# EAGLE design main (EAGLE 7.2.0)
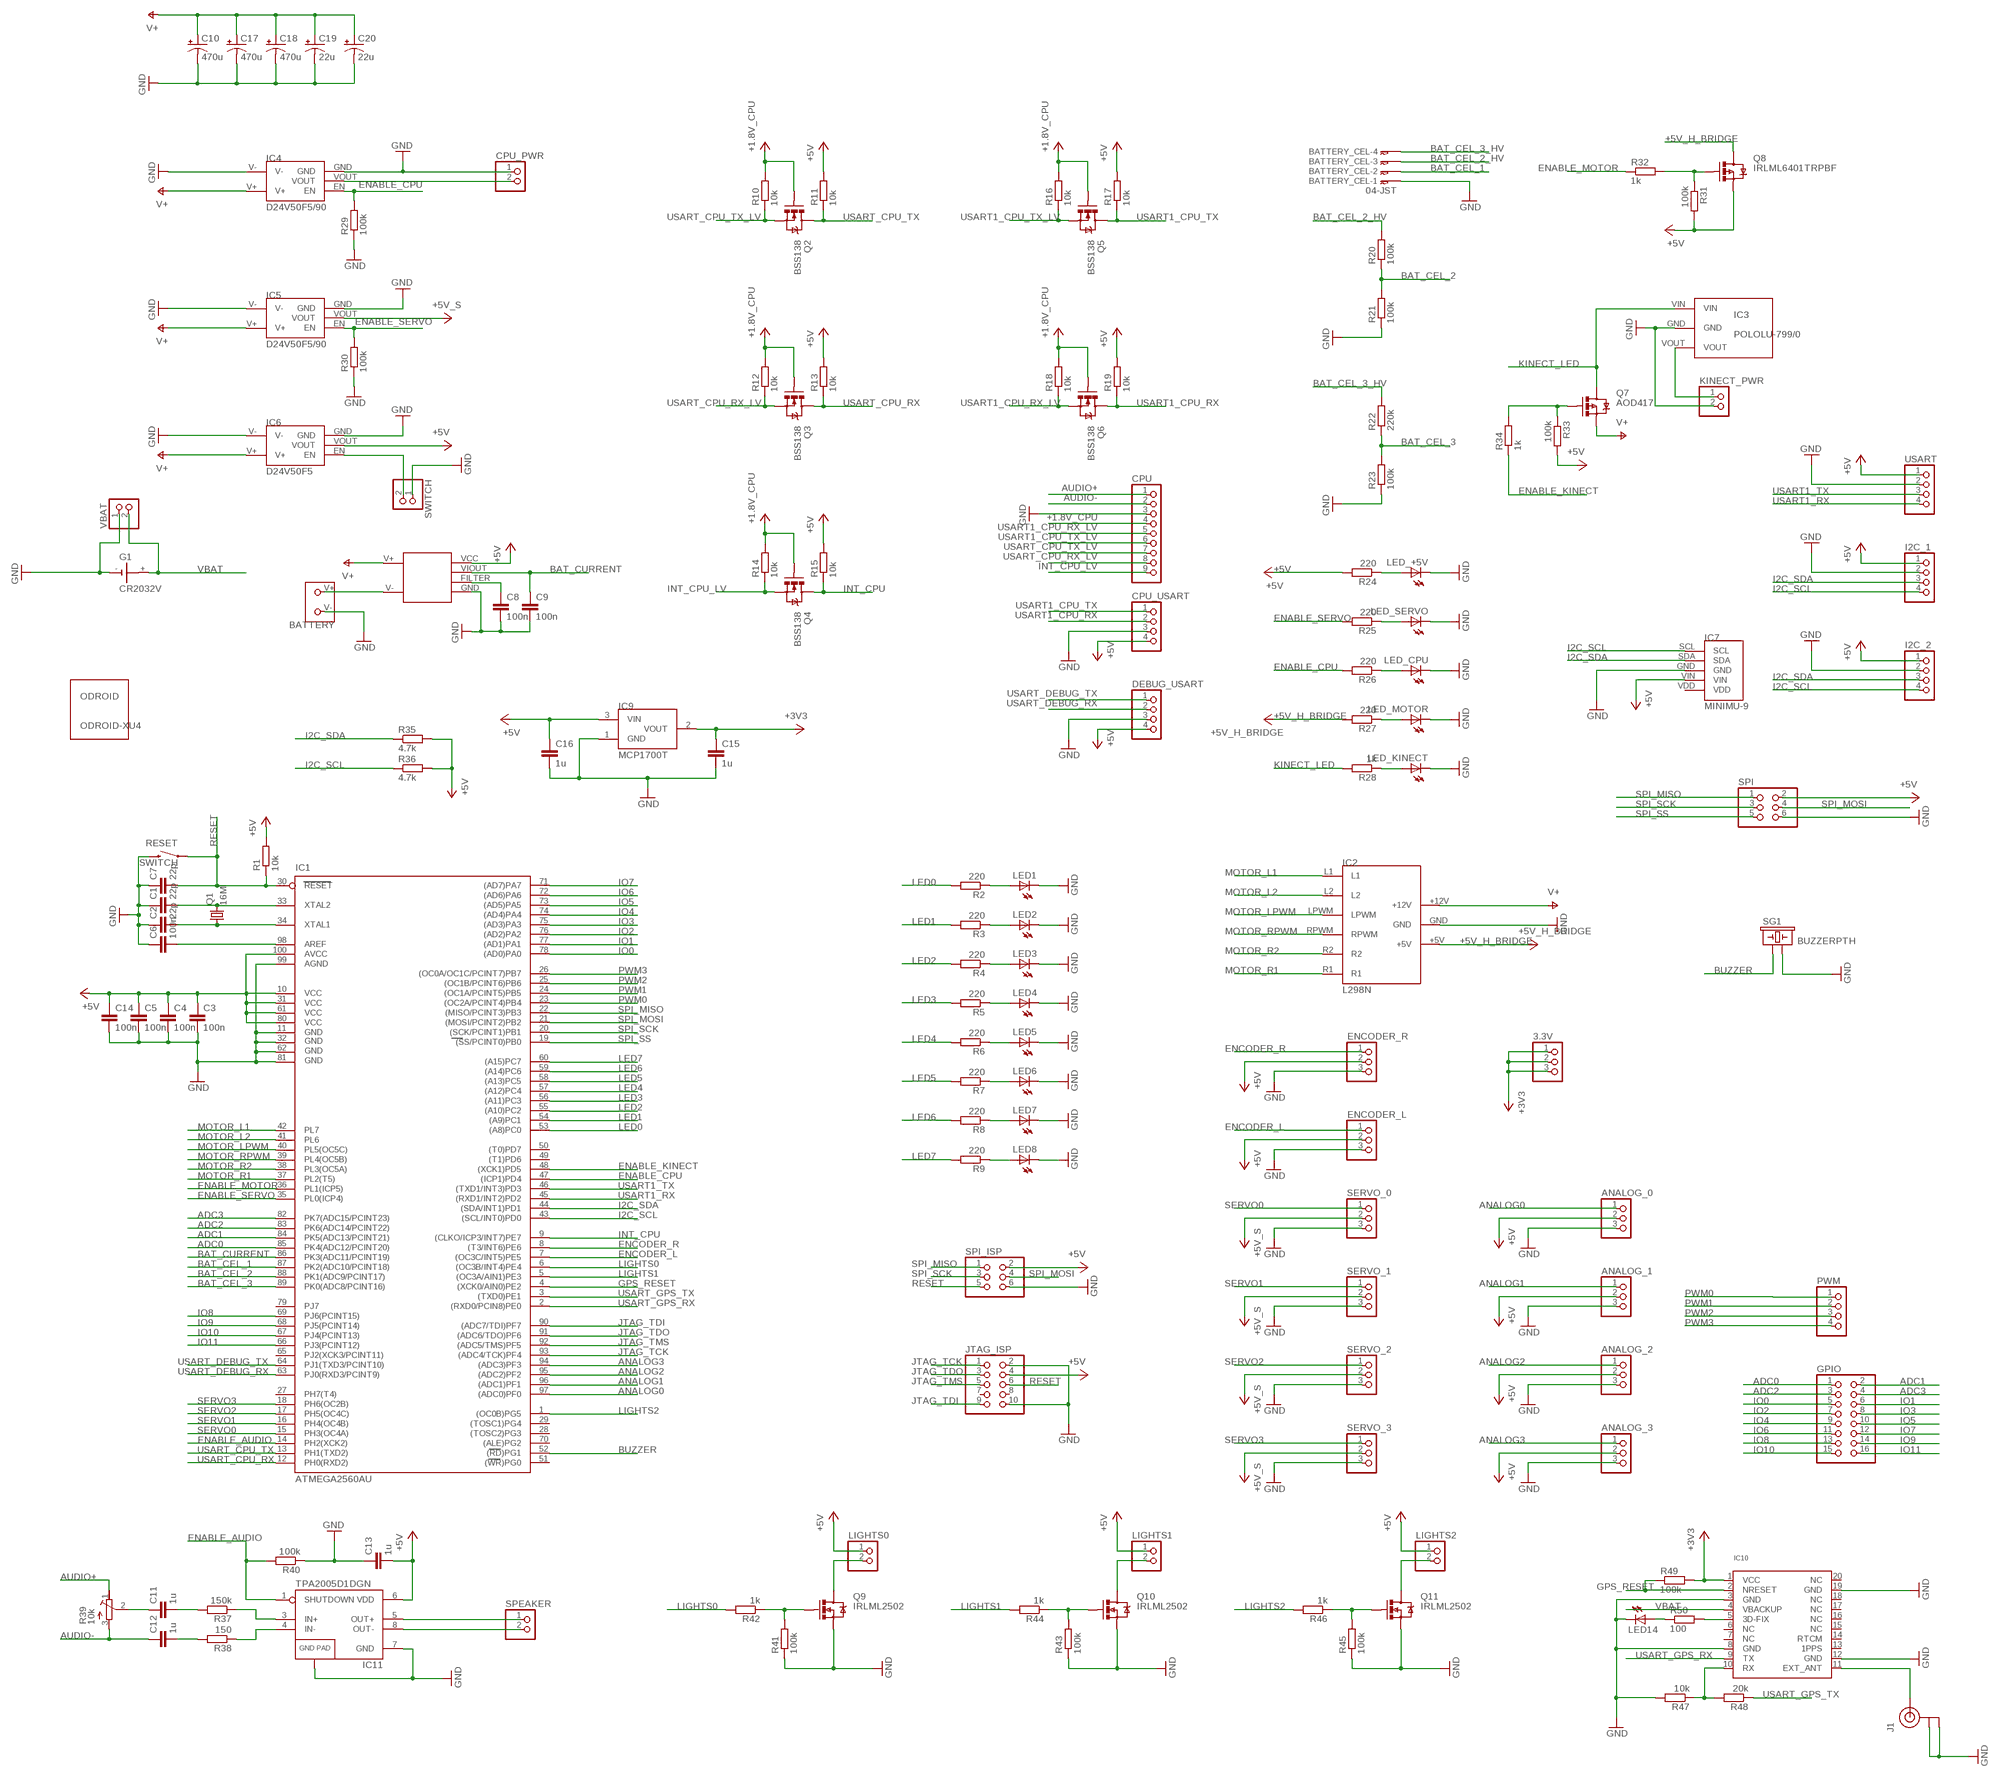
[diagram p0: schematic, sheet 1]

## Parts
3.3V  PINHD-1X3  [1X03]
ANALOG_0  PINHD-1X3  [1X03]
ANALOG_1  PINHD-1X3  [1X03]
ANALOG_2  PINHD-1X3  [1X03]
ANALOG_3  PINHD-1X3  [1X03]
BATTERY  XT60  [XT60]
BATTERY_CEL  04-JST  04-JST-B4B-XH-A  [B4B-XH]
C1  22p  C-EUC0805  [C0805]
C2  22p  C-EUC0805  [C0805]
C3  100n  C-EUC0805  [C0805]
C4  100n  C-EUC0805  [C0805]
C5  100n  C-EUC0805  [C0805]
C6  100n  C-EUC0805  [C0805]
C7  22p  C-EUC0805  [C0805]
C8  100n  C-EUC0805  [C0805]
C9  100n  C-EUC0805  [C0805]
C10  470u  CAP_POLG  [PANASONIC_G]
C11  1u  C-EUC0805  [C0805]
C12  1u  C-EUC0805  [C0805]
C13  1u  C-EUC0805  [C0805]
C14  100n  C-EUC0805  [C0805]
C15  1u  C-EUC0805  [C0805]
C16  1u  C-EUC0805  [C0805]
C17  470u  CAP_POLG  [PANASONIC_G]
C18  470u  CAP_POLG  [PANASONIC_G]
C19  22u  CAP_POL6032  [EIA6032]
C20  22u  CAP_POL6032  [EIA6032]
CPU  PINHD-1X9  [1X09]
CPU_PWR  PINHD-1X2  [1X02]
CPU_USART  PINHD-1X4/90  [1X04/90]
DEBUG_USART  PINHD-1X4/90  [1X04/90]
ENCODER_L  PINHD-1X3  [1X03]
ENCODER_R  PINHD-1X3  [1X03]
G1  CR2032V  [CR2032V]
GPIO  PINHD-2X8  [2X08]
I2C_1  PINHD-1X4  [1X04]
I2C_2  PINHD-1X4  [1X04]
IC1  ATMEGA2560AU  [TQFP100]
IC2  L298N  [L298N-MOD]
IC3  POLOLU-799/0  [POLOLU799/0]
IC4  D24V50F5/90  [D24V50/90]
IC5  D24V50F5/90  [D24V50/90]
IC6  D24V50F5  [D24V50]
IC7  MINIMU-9  [MINIMU-9_V3]
IC8  ACS715  [ACS71X]
IC9  MCP1700T  [SOT23]
IC10  GPS_FGPMMOPA6H  [FGPMMOPA6H]
IC11  TPA2005D1DGN  [POWER-SOP8]
J1  U.FL  [U.FL]
JTAG_ISP  PINHD-2X5/90  [2X05/90]
KINECT_PWR  PINHD-1X2  [1X02]
LED1  LEDCHIPLED_0805  [CHIPLED_0805]
LED2  LEDCHIPLED_0805  [CHIPLED_0805]
LED3  LEDCHIPLED_0805  [CHIPLED_0805]
LED4  LEDCHIPLED_0805  [CHIPLED_0805]
LED5  LEDCHIPLED_0805  [CHIPLED_0805]
LED6  LEDCHIPLED_0805  [CHIPLED_0805]
LED7  LEDCHIPLED_0805  [CHIPLED_0805]
LED8  LEDCHIPLED_0805  [CHIPLED_0805]
LED14  LEDCHIPLED_0805  [CHIPLED_0805]
LED_+5V  LEDCHIPLED_0805  [CHIPLED_0805]
LED_CPU  LEDCHIPLED_0805  [CHIPLED_0805]
LED_KINECT  LEDCHIPLED_0805  [CHIPLED_0805]
LED_MOTOR  LEDCHIPLED_0805  [CHIPLED_0805]
LED_SERVO  LEDCHIPLED_0805  [CHIPLED_0805]
LIGHTS0  PINHD-1X2  [1X02]
LIGHTS1  PINHD-1X2  [1X02]
LIGHTS2  PINHD-1X2  [1X02]
ODROID  ODROID-XU4  [ODROID-XU4]
PWM  PINHD-1X4  [1X04]
Q1  16M  CRYSTALTXC-7A  [CRYSTAL-TXC-7A]
Q2  BSS138  MOSFET-NCHANNELBSS138  [SOT23-3]
Q3  BSS138  MOSFET-NCHANNELBSS138  [SOT23-3]
Q4  BSS138  MOSFET-NCHANNELBSS138  [SOT23-3]
Q5  BSS138  MOSFET-NCHANNELBSS138  [SOT23-3]
Q6  BSS138  MOSFET-NCHANNELBSS138  [SOT23-3]
Q7  AOD417  [TO252]
Q8  IRLML6401TRPBF  [SOT23]
Q9  IRLML2502  [SOT23]
Q10  IRLML2502  [SOT23]
Q11  IRLML2502  [SOT23]
R1  10k  R-EU_R0805  [R0805]
R2  220  R-EU_R0805  [R0805]
R3  220  R-EU_R0805  [R0805]
R4  220  R-EU_R0805  [R0805]
R5  220  R-EU_R0805  [R0805]
R6  220  R-EU_R0805  [R0805]
R7  220  R-EU_R0805  [R0805]
R8  220  R-EU_R0805  [R0805]
R9  220  R-EU_R0805  [R0805]
R10  10k  R-EU_R0805  [R0805]
R11  10k  R-EU_R0805  [R0805]
R12  10k  R-EU_R0805  [R0805]
R13  10k  R-EU_R0805  [R0805]
R14  10k  R-EU_R0805  [R0805]
R15  10k  R-EU_R0805  [R0805]
R16  10k  R-EU_R0805  [R0805]
R17  10k  R-EU_R0805  [R0805]
R18  10k  R-EU_R0805  [R0805]
R19  10k  R-EU_R0805  [R0805]
R20  100k  R-EU_R0805  [R0805]
R21  100k  R-EU_R0805  [R0805]
R22  220k  R-EU_R0805  [R0805]
R23  100k  R-EU_R0805  [R0805]
R24  220  R-EU_R0805  [R0805]
R25  220  R-EU_R0805  [R0805]
R26  220  R-EU_R0805  [R0805]
R27  220  R-EU_R0805  [R0805]
R28  1k  R-EU_R0805  [R0805]
R29  100k  R-EU_R0805  [R0805]
R30  100k  R-EU_R0805  [R0805]
R31  100k  R-EU_R0805  [R0805]
R32  1k  R-EU_R0805  [R0805]
R33  100k  R-EU_R0805  [R0805]
R34  1k  R-EU_R0805  [R0805]
R35  4.7k  R-EU_R0805  [R0805]
R36  4.7k  R-EU_R0805  [R0805]
R37  150k  R-EU_R0805  [R0805]
R38  150  R-EU_R0805  [R0805]
R39  10k  R-TRIMM3314G  [RTRIM3314G]
R40  100k  R-EU_R0805  [R0805]
R41  100k  R-EU_R0805  [R0805]
R42  1k  R-EU_R0805  [R0805]
R43  100k  R-EU_R0805  [R0805]
R44  1k  R-EU_R0805  [R0805]
R45  100k  R-EU_R0805  [R0805]
R46  1k  R-EU_R0805  [R0805]
R47  10k  R-EU_R0805  [R0805]
R48  20k  R-EU_R0805  [R0805]
R49  100k  R-EU_R0805  [R0805]
R50  100  R-EU_R0805  [R0805]
RESET  SWITCH  SWITCH-MOMENTARY-2SMD-4  [TACTILE_SWITCH_TALL]
SERVO_0  PINHD-1X3  [1X03]
SERVO_1  PINHD-1X3  [1X03]
SERVO_2  PINHD-1X3  [1X03]
SERVO_3  PINHD-1X3  [1X03]
SG1  BUZZERPTH  [BUZZER-12MM]
SPEAKER  PINHD-1X2  [1X02]
SPI  PINHD-2X3  [2X03]
SPI_ISP  PINHD-2X3  [2X03]
SWITCH  PINHD-1X2/90  [1X02/90]
USART  PINHD-1X4  [1X04]
VBAT  PINHD-1X2  [1X02]

## Nets
+1.8V_CPU: CPU.4 Q2.1(G) Q3.1(G) Q4.1(G) Q5.1(G) Q6.1(G) R10.2 R12.2 R14.2 R16.2 R18.2
+3V3: 3.3V.1 3.3V.2 3.3V.3 C15.1 IC9.2(VOUT) IC10.1(VCC) R49.2
+5V: ANALOG_0.2 ANALOG_1.2 ANALOG_2.2 ANALOG_3.2 C3.1 C4.1 C5.1 C13.2 C14.1 C16.1 CPU_USART.4 DEBUG_USART.4 ENCODER_L.2 ENCODER_R.2 I2C_1.1 I2C_2.1 IC1.10(VCC) IC1.31(VCC1) IC1.61(VCC2) IC1.80(VCC3) IC1.100(AVCC) IC6.VOUT IC7.VIN IC8.VCC IC9.3(VIN) IC11.6(VDD) JTAG_ISP.4 LIGHTS0.1 LIGHTS1.1 LIGHTS2.1 Q8.2(S) R1.2 R11.2 R13.2 R15.2 R17.2 R19.2 R24.2 R31.2 R33.2 R35.2 R36.2 SPI.2 SPI_ISP.2 USART.1
+5V_CPU: CPU_PWR.2 IC4.VOUT
+5V_H_BRIDGE: IC2.+5V Q8.3(D) R27.2
+5V_S: IC5.VOUT SERVO_0.2 SERVO_1.2 SERVO_2.2 SERVO_3.2
ADC0: GPIO.1 IC1.85(PK4(ADC12/PCINT20))
ADC1: GPIO.2 IC1.84(PK5(ADC13/PCINT21))
ADC2: GPIO.3 IC1.83(PK6(ADC14/PCINT22))
ADC3: GPIO.4 IC1.82(PK7(ADC15/PCINT23))
ANALOG0: ANALOG_0.1 IC1.97((ADC0)PF0)
ANALOG1: ANALOG_1.1 IC1.96((ADC1)PF1)
ANALOG2: ANALOG_2.1 IC1.95((ADC2)PF2)
ANALOG3: ANALOG_3.1 IC1.94((ADC3)PF3)
AUDIO+: CPU.1 R39.1(E)
AUDIO-: C12.1 CPU.2 R39.3(A)
BAT_CEL_1: BATTERY_CEL.P$2 IC1.87(PK2(ADC10/PCINT18))
BAT_CEL_2: IC1.88(PK1(ADC9/PCINT17)) R20.1 R21.2
BAT_CEL_2_HV: BATTERY_CEL.P$3 R20.2
BAT_CEL_3: IC1.89(PK0(ADC8/PCINT16)) R22.1 R23.2
BAT_CEL_3_HV: BATTERY_CEL.P$4 R22.2
BAT_CURRENT: C9.1 IC1.86(PK3(ADC11/PCINT19)) IC8.VIOUT
BUZZER: IC1.52((RD)PG1) SG1.+
ENABLE: IC6.EN SWITCH.2
ENABLE_AUDIO: IC1.14(PH2(XCK2)) IC11.1(SHUTDOWN) R40.2
ENABLE_CPU: IC1.47((ICP1)PD4) IC4.EN R26.2 R29.2
ENABLE_KINECT: IC1.48((XCK1)PD5) R34.1
ENABLE_MOTOR: IC1.36(PL1(ICP5)) R32.1
ENABLE_SERVO: IC1.35(PL0(ICP4)) IC5.EN R25.2 R30.2
ENCODER_L: ENCODER_L.1 IC1.7((OC3C/INT5)PE5)
ENCODER_R: ENCODER_R.1 IC1.8((T3/INT6)PE6)
GND: ANALOG_0.3 ANALOG_1.3 ANALOG_2.3 ANALOG_3.3 BATTERY.V- BATTERY_CEL.P$1 C1.1 C2.1 C3.2 C4.2 C5.2 C6.1 C7.1 C8.2 C9.2 C10.- C13.1 C14.2 C15.2 C16.2 C17.- C18.- C19.P$2(-) C20.P$2(-) CPU.3 CPU_PWR.1 CPU_USART.3 DEBUG_USART.3 ENCODER_L.3 ENCODER_R.3 G1.- I2C_1.2 I2C_2.2 IC1.11(GND) IC1.32(GND1) IC1.62(GND2) IC1.81(GND3) IC1.99(AGND) IC2.GND IC3.GND IC4.GND IC4.V- IC5.GND IC5.V- IC6.GND IC6.V- IC7.GND IC8.GND IC9.1(GND) IC10.3(GND) IC10.8(GND) IC10.12(GND) IC10.19(GND) IC11.7(GND) IC11.9(GND) J1.P$1(GND) J1.P$2(GND) JTAG_ISP.2 JTAG_ISP.10 KINECT_PWR.2 LED1.C LED2.C LED3.C LED4.C LED5.C LED6.C LED7.C LED8.C LED14.C LED_+5V.C LED_CPU.C LED_KINECT.C LED_MOTOR.C LED_SERVO.C Q9.2(S) Q10.2(S) Q11.2(S) R21.1 R23.1 R29.1 R30.1 R40.1 R41.1 R43.1 R45.1 R47.2 RESET.B2 SERVO_0.3 SERVO_1.3 SERVO_2.3 SERVO_3.3 SG1.- SPI.6 SPI_ISP.6 SWITCH.1 USART.2 VBAT.1
GPS_RESET: IC1.4((XCK0/AIN0)PE2) IC10.2(NRESET) R49.1
I2C_SCL: I2C_1.4 I2C_2.4 IC1.43((SCL/INT0)PD0) IC7.SCL R36.1
I2C_SDA: I2C_1.3 I2C_2.3 IC1.44((SDA/INT1)PD1) IC7.SDA R35.1
INT_CPU: IC1.9((CLKO/ICP3/INT7)PE7) Q4.3(D) R15.1
INT_CPU_LV: CPU.9 Q4.2(S) R14.1
IO0: GPIO.5 IC1.78((AD0)PA0)
IO1: GPIO.6 IC1.77((AD1)PA1)
IO2: GPIO.7 IC1.76((AD2)PA2)
IO3: GPIO.8 IC1.75((AD3)PA3)
IO4: GPIO.9 IC1.74((AD4)PA4)
IO5: GPIO.10 IC1.73((AD5)PA5)
IO6: GPIO.11 IC1.72((AD6)PA6)
IO7: GPIO.12 IC1.71((AD7)PA7)
IO8: GPIO.13 IC1.69(PJ6(PCINT15))
IO9: GPIO.14 IC1.68(PJ5(PCINT14))
IO10: GPIO.15 IC1.67(PJ4(PCINT13))
IO11: GPIO.16 IC1.66(PJ3(PCINT12))
JTAG_TCK: IC1.93((ADC4/TCK)PF4) JTAG_ISP.1
JTAG_TDI: IC1.90((ADC7/TDI)PF7) JTAG_ISP.9
JTAG_TDO: IC1.91((ADC6/TDO)PF6) JTAG_ISP.3
JTAG_TMS: IC1.92((ADC5/TMS)PF5) JTAG_ISP.5
KINECT_LED: IC3.VIN Q7.3(D) R28.2
LED0: IC1.53((A8)PC0) R2.2
LED1: IC1.54((A9)PC1) R3.2
LED2: IC1.55((A10)PC2) R4.2
LED3: IC1.56((A11)PC3) R5.2
LED4: IC1.57((A12)PC4) R6.2
LED5: IC1.58((A13)PC5) R7.2
LED6: IC1.59((A14)PC6) R8.2
LED7: IC1.60((A15)PC7) R9.2
LIGHTS0: IC1.6((OC3B/INT4)PE4) R42.2
LIGHTS1: IC1.5((OC3A/AIN1)PE3) R44.2
LIGHTS2: IC1.1((OC0B)PG5) R46.2
MOTOR_L1: IC1.42(PL7) IC2.L1
MOTOR_L2: IC1.41(PL6) IC2.L2
MOTOR_LPWM: IC1.40(PL5(OC5C)) IC2.LPWM
MOTOR_R1: IC1.37(PL2(T5)) IC2.R1
MOTOR_R2: IC1.38(PL3(OC5A)) IC2.R2
MOTOR_RPWM: IC1.39(PL4(OC5B)) IC2.RPWM
N$1: C1.2 IC1.33(XTAL2) Q1.P$2
N$2: C2.2 IC1.34(XTAL1) Q1.P$1
N$3: C6.2 IC1.98(AREF)
N$4: LED1.A R2.1
N$5: LED2.A R3.1
N$6: LED3.A R4.1
N$7: LED4.A R5.1
N$8: LED5.A R6.1
N$9: LED6.A R7.1
N$10: LED7.A R8.1
N$11: LED8.A R9.1
N$12: LED_+5V.A R24.1
N$13: BATTERY.V+ IC8.V-
N$14: Q8.1(G) R31.1 R32.2
N$15: IC3.VOUT KINECT_PWR.1
N$16: LED_SERVO.A R25.1
N$17: C8.1 IC8.FILTER
N$18: LED_CPU.A R26.1
N$19: LED_MOTOR.A R27.1
N$20: LED_KINECT.A R28.1
N$21: Q7.1(G) R33.1 R34.2
N$22: IC11.3(IN+) R37.1
N$23: IC11.4(IN-) R38.1
N$24: C11.2 R37.2
N$25: C12.2 R38.2
N$26: IC11.5(OUT+) SPEAKER.1
N$27: C11.1 R39.2(S)
N$28: IC11.8(OUT-) SPEAKER.2
N$29: LIGHTS0.2 Q9.3(D)
N$30: Q9.1(G) R41.2 R42.1
N$31: LIGHTS1.2 Q10.3(D)
N$32: Q10.1(G) R43.2 R44.1
N$33: LIGHTS2.2 Q11.3(D)
N$34: Q11.1(G) R45.2 R46.1
N$35: IC10.10(RX) R47.1 R48.2
N$36: IC10.5(3D-FIX) R50.2
N$37: LED14.A R50.1
N$38: IC10.11(EXT_ANT) J1.P$3(SIGNAL)
PWM0: IC1.23((OC2A/PCINT4)PB4) PWM.1
PWM1: IC1.24((OC1A/PCINT5)PB5) PWM.2
PWM2: IC1.25((OC1B/PCINT6)PB6) PWM.3
PWM3: IC1.26((OC0A/OC1C/PCINT7)PB7) PWM.4
RESET: C7.2 IC1.30(RESET) JTAG_ISP.6 R1.1 RESET.A2 SPI_ISP.5
SERVO0: IC1.15(PH3(OC4A)) SERVO_0.1
SERVO1: IC1.16(PH4(OC4B)) SERVO_1.1
SERVO2: IC1.17(PH5(OC4C)) SERVO_2.1
SERVO3: IC1.18(PH6(OC2B)) SERVO_3.1
SPI_MISO: IC1.22((MISO/PCINT3)PB3) SPI.1 SPI_ISP.1
SPI_MOSI: IC1.21((MOSI/PCINT2)PB2) SPI.4 SPI_ISP.4
SPI_SCK: IC1.20((SCK/PCINT1)PB1) SPI.3 SPI_ISP.3
SPI_SS: IC1.19((SS/PCINT0)PB0) SPI.5
USART1_CPU_RX: CPU_USART.2 Q6.3(D) R19.1
USART1_CPU_RX_LV: CPU.5 Q6.2(S) R18.1
USART1_CPU_TX: CPU_USART.1 Q5.3(D) R17.1
USART1_CPU_TX_LV: CPU.6 Q5.2(S) R16.1
USART1_RX: IC1.45((RXD1/INT2)PD2) USART.4
USART1_TX: IC1.46((TXD1/INT3)PD3) USART.3
USART_CPU_RX: IC1.12(PH0(RXD2)) Q3.3(D) R13.1
USART_CPU_RX_LV: CPU.8 Q3.2(S) R12.1
USART_CPU_TX: IC1.13(PH1(TXD2)) Q2.3(D) R11.1
USART_CPU_TX_LV: CPU.7 Q2.2(S) R10.1
USART_DEBUG_RX: DEBUG_USART.2 IC1.63(PJ0(RXD3/PCINT9))
USART_DEBUG_TX: DEBUG_USART.1 IC1.64(PJ1(TXD3/PCINT10))
USART_GPS_RX: IC1.2((RXD0/PCIN8)PE0) IC10.9(TX)
USART_GPS_TX: IC1.3((TXD0)PE1) R48.1
V+: C10.+ C17.+ C18.+ C19.P$1(+) C20.P$1(+) IC2.+12V IC4.V+ IC5.V+ IC6.V+ IC8.V+ Q7.2(S)
VBAT: G1.+ IC10.4(VBACKUP) VBAT.2
Unconnected: G1.+@1(+) IC1.27(PH7(T4)) IC1.28((TOSC2)PG3) IC1.29((TOSC1)PG4) IC1.49((T1)PD6) IC1.50((T0)PD7) IC1.51((WR)PG0) IC1.65(PJ2(XCK3/PCINT11)) IC1.70((ALE)PG2) IC1.79(PJ7) IC7.VDD IC10.6(NC) IC10.7(NC) IC10.13(1PPS) IC10.14(RTCM) IC10.15(NC) IC10.16(NC) IC10.17(NC) IC10.18(NC) IC10.20(NC) JTAG_ISP.7 JTAG_ISP.8

## Library data of the parts
3.3V ANALOG_0 ANALOG_1-ANALOG_3 ENCODER_L ENCODER_R SERVO_0 SERVO_1-SERVO_3 = pinhead:PINHD-1X3: PIN HEADER
BATTERY = parts:XT60
BATTERY_CEL = bt_con-jst-xh:04-JST: JST CONNECTOR
C1-C9 C11-C16 = resistor:C-EU: CAPACITOR, European symbol
C10 C17 C18 = SparkFun-Capacitors:CAP_POL: Capacitor Polarized These are standard SMD and PTH capacitors. Normally 10uF, 47uF, and 100uF in electrolytic and tantalum varieties. Always verify the external diameter of the through hole cap, it varies with capacity, voltage, and manufacturer. The EIA devices should be standard.
C19 C20 = SparkFun-Passives:CAP_POL: Capacitor Polarized These are standard SMD and PTH capacitors. Normally 10uF, 47uF, and 100uF in electrolytic and tantalum varieties. Always verify the external diameter of the through hole cap, it varies with capacity, voltage, and manufacturer. The EIA devices should be standard.
CPU = pinhead:PINHD-1X9: PIN HEADER
CPU_PWR KINECT_PWR LIGHTS0 LIGHTS1 LIGHTS2 SPEAKER SWITCH VBAT = pinhead:PINHD-1X2: PIN HEADER
CPU_USART DEBUG_USART I2C_1 I2C_2 PWM USART = pinhead:PINHD-1X4: PIN HEADER
G1 = battery:CR2032V: LI BATTERY Varta
GPIO = pinhead:PINHD-2X8: PIN HEADER
IC1 = SmartPrj:ATMEGA2560: MICROCONTROLLER 64/128/256 Kbytes FLASH 4 Kbytes EEPROM 8 Kbytes SRAM 86 General Purpose I/O pins 12-channels16-bit PWM 4 x Serial USARTs 16-channels 10-bit A/D
IC2 = parts:L298N
IC3 = parts:POLOLU-799
IC4-IC6 = parts:D24V50F5
IC7 = parts:MINIMU-9
IC8 = parts:ACS715
IC9 = parts:MCP1700T
IC10 = Simplex-ICs:GPS_FGPMMOPA6H: GPS Module - MTK MT3339 Chipset, -165dBm sensitivity, 22 channels, 10Hz, auto-select external antenna options
IC11 = SparkFun-AnalogIC:TPA2005D1: 1.4W MONO CLASS-D AUDIO POWER AMPLIFIER The TPA2005D1 is a 1.4-W high efficiency filter-free class-D audio power amplifier in a BGA, QFN, or MSOP package that requires only three external components. Datasheet: http://focus.ti.com/lit/ds/symlink/tpa2005d1.pdf 1.4 W Into 8 ? From a 5V Supply at THD = 10% (Typ) Maximum Battery Life and Minimum Heat Efficiency With an 8-? Speaker: 84% at 400 mW, 79% at 100 mW 2.8-mA Quiescent Current 0.5-mA Shutdown Current Ideal for Wireless or Cellular Handsets and PDAs Capable of Driving an 8-? Speaker (2.5 V ? VDD ? 5.5 V) and a 4-? Speaker (2.5 V ? VDD ? 4.2 V) Only Three External Components Optimized PWM Output Stage Eliminates LC Output Filter Internally Generated 250-kHz Switching Frequency Eliminates Capacitor and Resistor Improved PSRR (-71 dB at 217 Hz) and Wide Supply Voltage (2.5 V to 5.5 V) Eliminates Need for a Voltage Regulator Fully Differential Design Reduces RF Rectification and Eliminates Bypass Capacitor Improved CMRR Eliminates Two Input Coupling Capacitors
J1 = SparkFun-Connectors:U.FL: SMD antenna connector- WRL-09144; PROD_ID: CONN-09193
JTAG_ISP = pinhead:PINHD-2X5: PIN HEADER
LED1-LED8 LED14 LED_+5V LED_CPU LED_KINECT LED_MOTOR LED_SERVO = led:LED: LED OSRAM: - CHIPLED LG R971, LG N971, LY N971, LG Q971, LY Q971, LO R971, LY R971 LH N974, LH R974 LS Q976, LO Q976, LY Q976 LO Q996 - Hyper CHIPLED LW Q18S LB Q993, LB Q99A, LB R99A - SideLED LS A670, LO A670, LY A670, LG A670, LP A670 LB A673, LV A673, LT A673, LW A673 LH A674 LY A675 LS A676, LA A676, LO A676, LY A676, LW A676 LS A679, LY A679, LG A679 - Hyper Micro SIDELED® LS Y876, LA Y876, LO Y876, LY Y876 LT Y87S - SmartLED LW L88C, LW L88S LB L89C, LB L89S, LG L890 LS L89K, LO L89K, LY L89K LS L896, LA L896, LO L896, LY L896 - TOPLED LS T670, LO T670, LY T670, LG T670, LP T670 LSG T670, LSP T670, LSY T670, LOP T670, LYG T670 LG T671, LOG T671, LSG T671 LB T673, LV T673, LT T673, LW T673 LH T674 LS T676, LA T676, LO T676, LY T676, LB T676, LH T676, LSB T676, LW T676 LB T67C, LV T67C, LT T67C, LS T67K, LO T67K, LY T67K, LW E67C LS E67B, LA E67B, LO E67B, LY E67B, LB E67C, LV E67C, LT E67C LW T67C LS T679, LY T679, LG T679 LS T770, LO T770, LY T770, LG T770, LP T770 LB T773, LV T773, LT T773, LW T773 LH T774 LS E675, LA E675, LY E675, LS T675 LS T776, LA T776, LO T776, LY T776, LB T776 LHGB T686 LT T68C, LB T68C - Hyper Mini TOPLED® LB M676 - Mini TOPLED Santana® LG M470 LS M47K, LO M47K, LY M47K Source: http://www.osram.convergy.de LUXEON: - LUMILED® LXK2-PW12-R00, LXK2-PW12-S00, LXK2-PW14-U00, LXK2-PW14-V00 LXK2-PM12-R00, LXK2-PM12-S00, LXK2-PM14-U00 LXK2-PE12-Q00, LXK2-PE12-R00, LXK2-PE12-S00, LXK2-PE14-T00, LXK2-PE14-U00 LXK2-PB12-K00, LXK2-PB12-L00, LXK2-PB12-M00, LXK2-PB14-N00, LXK2-PB14-P00, LXK2-PB14-Q00 LXK2-PR12-L00, LXK2-PR12-M00, LXK2-PR14-Q00, LXK2-PR14-R00 LXK2-PD12-Q00, LXK2-PD12-R00, LXK2-PD12-S00 LXK2-PH12-R00, LXK2-PH12-S00 LXK2-PL12-P00, LXK2-PL12-Q00, LXK2-PL12-R00 Source: www.luxeon.com KINGBRIGHT: KA-3528ASYC Source: www.kingbright.com
ODROID = parts:ODROID-XU4
Q1 = SparkFun-FreqCtrl:CRYSTAL: Various standard crystals. Proven footprints.
Q2-Q6 = SparkFun-DiscreteSemi:MOSFET-NCHANNEL: Common NMOSFET Parts MFG P/N Store ID Prod ID FDD8780 TRANS-09984 SI7820DN TRANS-11055 FDS6630A IC-08089 2N7002PW TRANS-11151 FQP30N06L COM-10213 TRANS-10060 BSS123LT1G TRANS-08345 BSS138 TRANS-00830 BS170 2N7000; PROD_ID: TRANS-00830; VALUE: 200mA/50V
Q7 = parts:AOD417
Q8 = parts:IRLML6401TRPBF
Q9-Q11 = parts:IRLML2502
R1-R38 R40-R50 = resistor:R-EU_: RESISTOR, European symbol
R39 = resistor:R-TRIMM: Trimm resistor
RESET = SparkFun-Electromechanical:SWITCH-MOMENTARY-2: Various NO switches- pushbuttons, reed, etc; PROD_ID: SWCH-11966
SG1 = SparkFun-Electromechanical:BUZZER: Buzzer 12mm Spark Fun Electronics SKU : Comp-Buzzer
SPI SPI_ISP = pinhead:PINHD-2X3: PIN HEADER

## Board
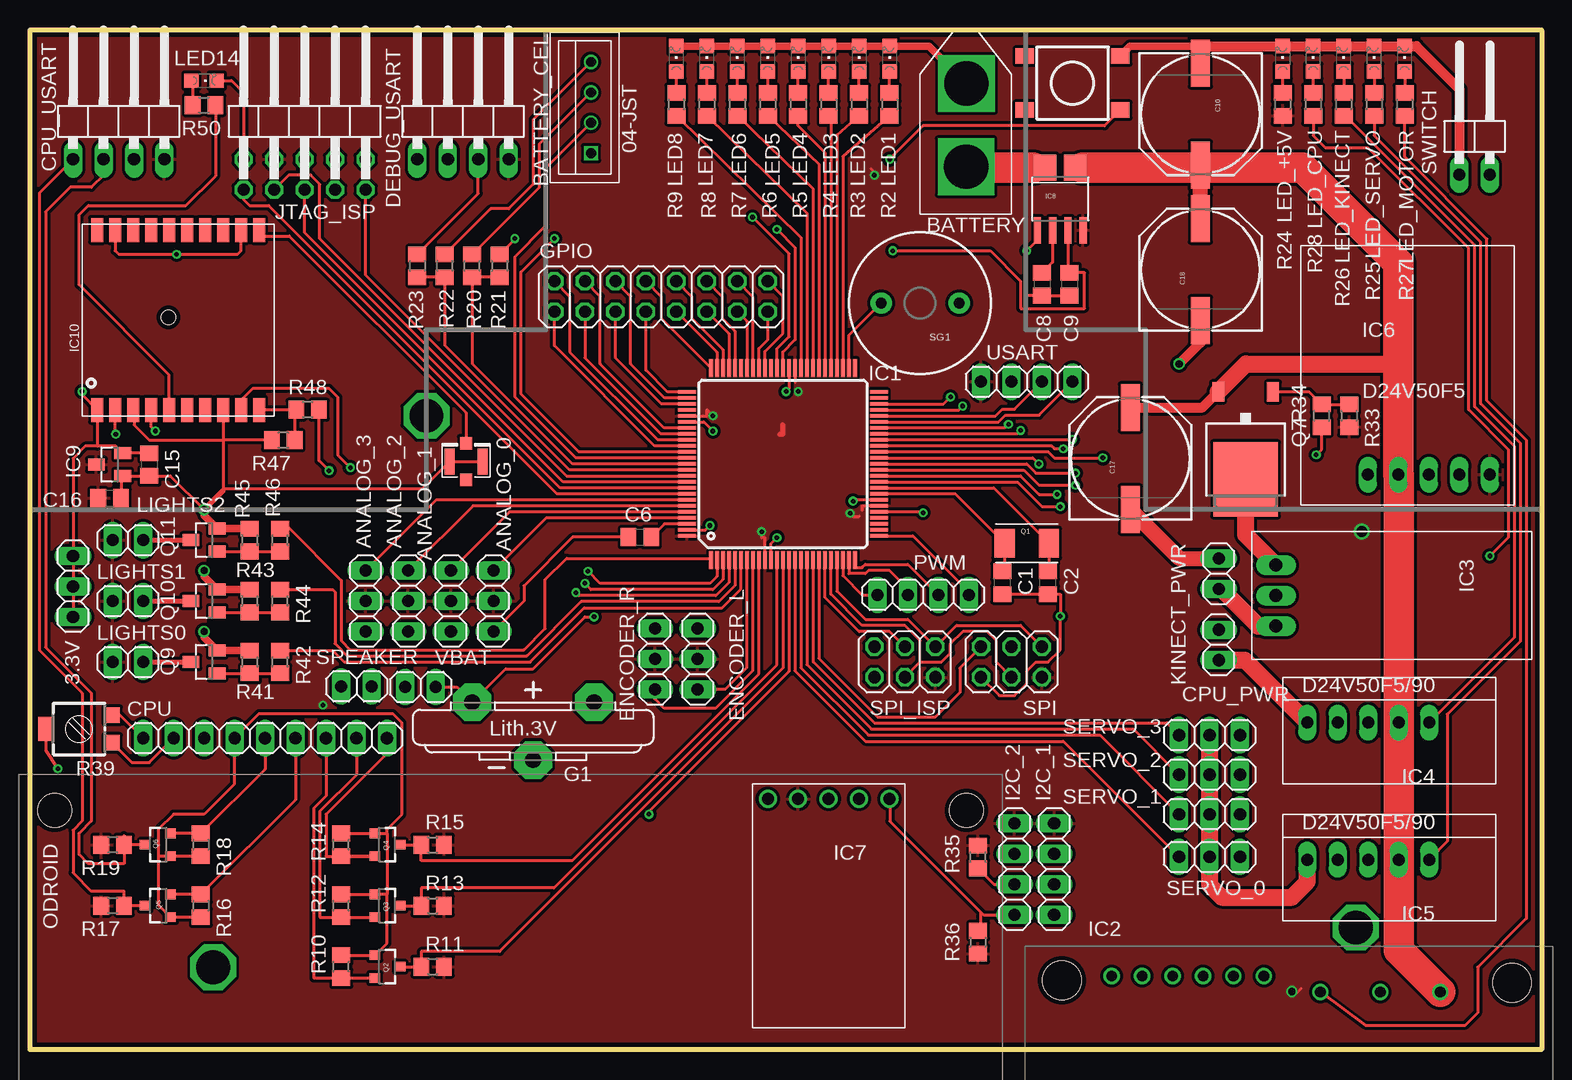
[diagram p1: board, top side]
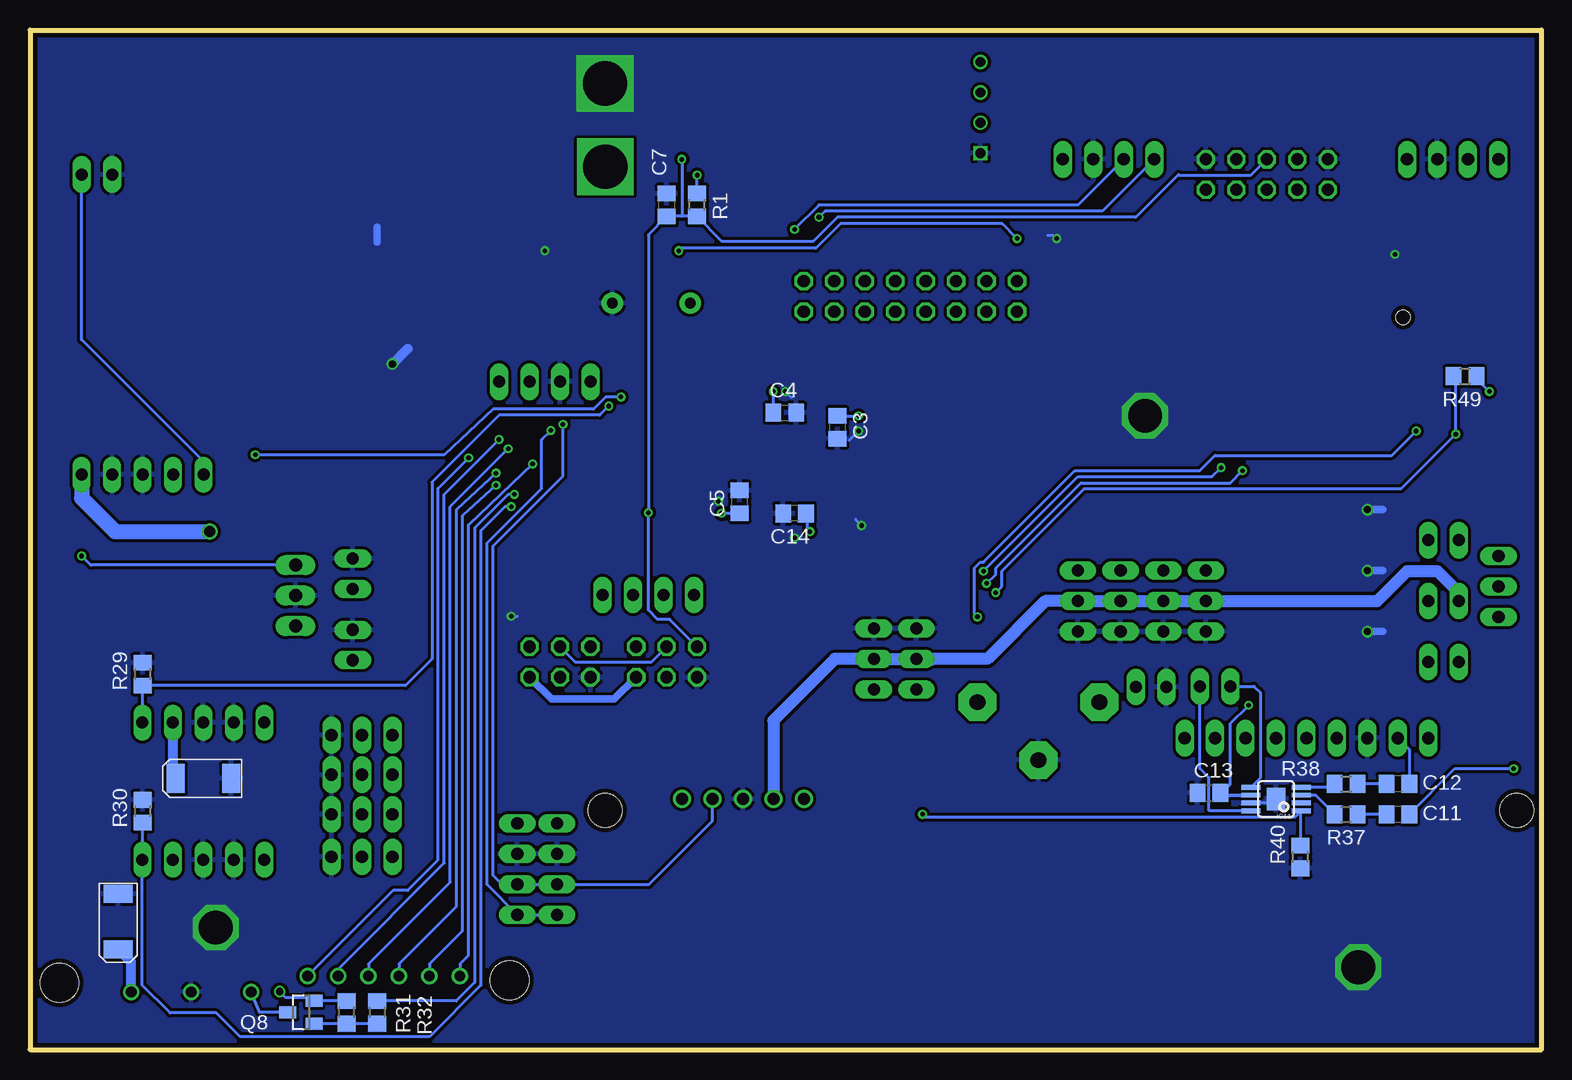
[diagram p2: board, bottom side, seen from below]

Size 126 x 85 mm. Coordinates in mm from the lower left corner, seen from the top.
Outline: 126,85 0,85 0,0 126,0 126,85
Copper layers (1*16): Top 0.0356mm / dielectric 1.5011mm / Bottom 0.0356mm
Design rules "oshpark-2layer *": minimum track width 6mil, minimum drill 13mil, track to track 6mil, track to pad 6mil, pad to pad 6mil, via to via 6mil, smd to smd 6mil, copper to edge 15mil, drill to drill 6mil, minimum pad ring 7mil, minimum via ring 7mil, stop-mask expansion 2.5mil, vias tented up to drill 25mil, thermal gap 10mil

### Footprints (pad centres in the part's own frame; a part is rotated, then mirrored left to right if it is on the bottom)
1X03 = drill 1.016 long: 1 -2.54,0; 2 0,0; 3 2.54,0
XT60 = drill 3.7 square: V+ 0.027,-3.154; V- 0.051,3.776
B4B-XH = drill 0.8 square: P$1 -3.81,0 | drill 0.8: P$2 -1.27,0; P$3 1.27,0; P$4 3.81,0
C0805 = smd 1.3 x 1.5: 1 -0.95,0; 2 0.95,0
PANASONIC_G = smd 3.9 x 1.6: + 4.25,0; - -4.25,0
EIA6032 = smd 1.5 x 2.4: P$1 -2.3,0; P$2 2.3,0
1X09 = drill 1.016 long: 1 -10.16,0; 2 -7.62,0; 3 -5.08,0; 4 -2.54,0; 5 0,0; 6 2.54,0; 7 5.08,0; 8 7.62,0; 9 10.16,0
1X02 = drill 1.016 long: 1 -1.27,0; 2 1.27,0
1X04/90 = drill 1.016 long: 1 -3.81,-3.81; 2 -1.27,-3.81; 3 1.27,-3.81; 4 3.81,-3.81
CR2032V = drill 1.321 pad 3.15 octagon: + -2.54,-5.08; +@1 -2.54,5.08; - 2.286,0
2X08 = drill 1.016 octagon: 1 -8.89,-1.27; 2 -8.89,1.27; 3 -6.35,-1.27; 4 -6.35,1.27; 5 -3.81,-1.27; 6 -3.81,1.27; 7 -1.27,-1.27; 8 -1.27,1.27; 9 1.27,-1.27; 10 1.27,1.27; 11 3.81,-1.27; 12 3.81,1.27; 13 6.35,-1.27; 14 6.35,1.27; 15 8.89,-1.27; 16 8.89,1.27
1X04 = drill 1.016 long: 1 -3.81,0; 2 -1.27,0; 3 1.27,0; 4 3.81,0
TQFP100 = smd 1.5 x 0.3: 1 -8,6; 2 -8,5.5; 3 -8,5; 4 -8,4.5; 5 -8,4; 6 -8,3.5; 7 -8,3; 8 -8,2.5; 9 -8,2; 10 -8,1.5; 11 -8,1; 12 -8,0.5; 13 -8,0; 14 -8,-0.5; 15 -8,-1; 16 -8,-1.5; 17 -8,-2; 18 -8,-2.5; 19 -8,-3; 20 -8,-3.5; 21 -8,-4; 22 -8,-4.5; 23 -8,-5; 24 -8,-5.5; 25 -8,-6; 51 8,-6; 52 8,-5.5; 53 8,-5; 54 8,-4.5; 55 8,-4; 56 8,-3.5; 57 8,-3; 58 8,-2.5; 59 8,-2; 60 8,-1.5; 61 8,-1; 62 8,-0.5; 63 8,0; 64 8,0.5; 65 8,1; 66 8,1.5; 67 8,2; 68 8,2.5; 69 8,3; 70 8,3.5; 71 8,4; 72 8,4.5; 73 8,5; 74 8,5.5; 75 8,6 | smd 0.3 x 1.5: 26 -6,-8; 27 -5.5,-8; 28 -5,-8; 29 -4.5,-8; 30 -4,-8; 31 -3.5,-8; 32 -3,-8; 33 -2.5,-8; 34 -2,-8; 35 -1.5,-8; 36 -1,-8; 37 -0.5,-8; 38 0,-8; 39 0.5,-8; 40 1,-8; 41 1.5,-8; 42 2,-8; 43 2.5,-8; 44 3,-8; 45 3.5,-8; 46 4,-8; 47 4.5,-8; 48 5,-8; 49 5.5,-8; 50 6,-8; 76 6,8; 77 5.5,8; 78 5,8; 79 4.5,8; 80 4,8; 81 3.5,8; 82 3,8; 83 2.5,8; 84 2,8; 85 1.5,8; 86 1,8; 87 0.5,8; 88 0,8; 89 -0.5,8; 90 -1,8; 91 -1.5,8; 92 -2,8; 93 -2.5,8; 94 -3,8; 95 -3.5,8; 96 -4,8; 97 -4.5,8; 98 -5,8; 99 -5.5,8; 100 -6,8
L298N-MOD = drill 0.9: +5V -2.614,-18.202; +12V -12.614,-18.202; GND -7.614,-18.202; L1 4.626,-19.541; L2 7.166,-19.541; LPWM 2.086,-19.541; R1 12.246,-19.541; R2 9.706,-19.541; RPWM 14.786,-19.541 | hole 3.2: -18.601,-18.971; 18.93,-19.183
POLOLU799/0 = drill 1.1 long: GND 0,0; VIN -2.54,0; VOUT 2.54,0
D24V50/90 = drill 1 long: EN -3.312,-1.299; GND 4.308,-1.299; V+ -0.772,-1.299; V- 1.768,-1.299; VOUT 6.848,-1.299
D24V50 = drill 1 long: EN -3.312,-8.919; GND 4.308,-8.919; V+ -0.772,-8.919; V- 1.768,-8.919; VOUT 6.848,-8.919
MINIMU-9_V3 = drill 1: GND 0,-11.43; SCL -5.08,-11.43; SDA -2.54,-11.43; VDD 5.08,-11.43; VIN 2.54,-11.43
ACS71X = smd 0.61 x 2.21: FILTER -0.635,-2.616; GND -1.905,-2.616; VCC 1.905,-2.616; VIOUT 0.635,-2.616 | smd 1.88 x 2.184: V+ 1.257,2.605; V- -1.268,2.605
SOT23 = smd 1 x 1.4: 1 -0.95,-1.1; 2 0.95,-1.1; 3 0,1.1
FGPMMOPA6H = smd 2 x 1: 1 0.5,14.75; 2 0.5,13.25; 3 0.5,11.75; 4 0.5,10.25; 5 0.5,8.75; 6 0.5,7.25; 7 0.5,5.75; 8 0.5,4.25; 9 0.5,2.75; 10 0.5,1.25; 11 15.5,1.25; 12 15.5,2.75; 13 15.5,4.25; 14 15.5,5.75; 15 15.5,7.25; 16 15.5,8.75; 17 15.5,10.25; 18 15.5,11.75; 19 15.5,13.25; 20 15.5,14.75 | hole 1.2: 8.2,8.8
POWER-SOP8 = smd 0.4 x 1.6: 1 -0.975,-2.1; 2 -0.325,-2.1; 3 0.325,-2.1; 4 0.975,-2.1; 5 0.975,2.1; 6 0.325,2.1; 7 -0.325,2.1; 8 -0.975,2.1 | smd 1.89 x 1.57: 9 0,0
U.FL = smd 2.2 x 0.85: P$1 0,1.375; P$2 0,-1.375 | smd 1.05 x 1: P$3 1.525,0; P$4 -1.525,0
2X05/90 = drill 1.016 octagon: 1 -5.08,-6.35; 2 -5.08,-3.81; 3 -2.54,-6.35; 4 -2.54,-3.81; 5 0,-6.35; 6 0,-3.81; 7 2.54,-6.35; 8 2.54,-3.81; 9 5.08,-6.35; 10 5.08,-3.81
CHIPLED_0805 = smd 1.2 x 1.2: A 0,-1.05; C 0,1.05
ODROID-XU4 = hole 2.8: 25,39; 25,-37
CRYSTAL-TXC-7A = smd 1.7 x 2.4: P$1 1.85,0; P$2 -1.85,0
SOT23-3 = smd 0.8 x 0.9: 1 -0.95,-1; 2 0.95,-1; 3 0,1.1
TO252 = smd 1 x 1.6: 1 -2.28,-4.8; 2 2.28,-4.8 | smd 5.4 x 6.2: 3 0,2.5
R0805 = smd 1.3 x 1.5: 1 -0.95,0; 2 0.95,0
RTRIM3314G = smd 1.3 x 1.3: 1 1.15,-2.75; 3 -1.15,-2.75 | smd 2 x 1.3: 2 0,2.75
TACTILE_SWITCH_TALL = smd 1.55 x 1.3: A1 -3.975,-2.25; A2 3.975,-2.25; B1 -3.975,2.25; B2 3.975,2.25
BUZZER-12MM = drill 0.9 pad 1.778: + 3.25,0; - -3.25,0
2X03 = drill 1.016 octagon: 1 -2.54,-1.27; 2 -2.54,1.27; 3 0,-1.27; 4 0,1.27; 5 2.54,-1.27; 6 2.54,1.27
1X02/90 = drill 1.016 long: 1 -1.27,-3.81; 2 1.27,-3.81

### Placement (x,y rotation side)
3.3V  3.59,38.61 270 top
ANALOG_0  38.64,37.39 270 top
ANALOG_1  35.08,37.39 270 top
ANALOG_2  31.53,37.39 270 top
ANALOG_3  27.97,37.39 270 top
BATTERY  78.01,76.76 0 top
BATTERY_CEL  46.77,78.54 90 top
C1  81.06,38.91 90 top
C2  84.87,38.91 90 top
C3  58.71,51.87 270 bottom
C4  63.08,53.09 0 bottom
C5  66.83,45.67 90 bottom
C6  50.83,42.72 0 top
C7  72.93,70.41 270 bottom
C8  84.36,63.81 270 top
C9  86.65,63.81 270 top
C10  97.57,77.98 270 top
C11  11.97,19.61 180 bottom
C12  11.97,22.15 180 bottom
C13  27.72,21.39 0 bottom
C14  62.26,44.7 180 bottom
C15  9.94,48.77 270 top
C16  6.64,45.97 0 top
C17  91.73,49.28 90 top
C18  97.57,65.02 90 top
C19  118.65,10.67 90 bottom
C20  111.54,22.61 0 bottom
CPU  19.59,25.96 0 top
CPU_PWR  99.09,33.73 270 top
CPU_USART  7.4,78.03 0 top
DEBUG_USART  36.1,78.03 0 top
ENCODER_L  55.66,32.56 90 top
ENCODER_R  52.1,32.56 90 top
G1  41.94,26.42 270 top
GPIO  52.61,62.79 0 top
I2C_1  85.38,15.04 270 top
I2C_2  82.07,15.04 270 top
IC1  62.77,48.82 90 top
IC2  104.95,-13.41 180 top
IC3  103.87,37.85 270 top
IC4  113.32,25.96 180 top
IC5  113.32,14.53 180 top
IC6  114.84,56.84 0 top
IC7  66.58,9.45 180 top
IC8  85.88,70.92 0 top
IC9  6.64,48.77 90 top
IC10  20.35,52.83 90 top
IC11  22.13,20.88 90 bottom
J1  36.35,49.02 90 top
JTAG_ISP  22.89,78.03 0 top
KINECT_PWR  99.09,39.68 90 top
LED1  71.66,82.6 0 top
LED2  69.12,82.6 0 top
LED3  66.58,82.6 0 top
LED4  64.04,82.6 0 top
LED5  61.5,82.6 0 top
LED6  58.96,82.6 0 top
LED7  56.42,82.6 0 top
LED8  53.88,82.6 0 top
LED14  14.51,80.77 270 top
LED_+5V  104.43,82.6 0 top
LED_CPU  109.51,82.6 0 top
LED_KINECT  106.97,82.6 0 top
LED_MOTOR  114.59,82.6 0 top
LED_SERVO  112.05,82.6 0 top
LIGHTS0  8.16,32.31 0 top
LIGHTS1  8.16,37.39 0 top
LIGHTS2  8.16,42.47 0 top
ODROID  41.06,-5.06 90 top
PWM  74.45,37.9 0 top
Q1  83.09,42.22 0 top
Q2  29.75,6.91 270 top
Q3  29.75,11.99 270 top
Q4  29.75,17.07 270 top
Q5  10.7,11.99 90 top
Q6  10.7,17.07 90 top
Q7  101.33,50.04 180 top
Q8  103.41,3.1 90 bottom
Q9  14.51,32.31 90 top
Q10  14.51,37.39 90 top
Q11  14.51,42.47 90 top
R1  70.39,70.41 90 bottom
R2  71.66,78.79 270 top
R3  69.12,78.79 270 top
R4  66.58,78.79 270 top
R5  64.04,78.79 270 top
R6  61.5,78.79 270 top
R7  58.96,78.79 270 top
R8  56.42,78.79 270 top
R9  53.88,78.79 270 top
R10  25.94,6.91 90 top
R11  33.56,6.91 0 top
R12  25.94,11.99 90 top
R13  33.56,11.99 0 top
R14  25.94,17.07 90 top
R15  33.56,17.07 0 top
R16  14.24,11.99 270 top
R17  6.89,11.99 180 top
R18  14.24,17.07 270 top
R19  6.89,17.07 180 top
R20  36.86,65.33 90 top
R21  39.15,65.33 270 top
R22  34.58,65.33 90 top
R23  32.29,65.33 270 top
R24  104.43,78.79 270 top
R25  112.05,78.79 270 top
R26  109.51,78.79 270 top
R27  114.59,78.79 270 top
R28  106.97,78.79 270 top
R29  116.62,31.29 270 bottom
R30  116.62,19.86 270 bottom
R31  99.6,3.1 90 bottom
R32  97.06,3.1 270 bottom
R33  109.96,52.83 270 top
R34  107.68,52.83 90 top
R35  79.03,16.05 90 top
R36  79.03,8.94 270 top
R37  16.29,19.61 0 bottom
R38  16.29,22.15 0 bottom
R39  4.1,26.72 90 top
R40  20.1,16.05 90 bottom
R41  18.32,32.31 270 top
R42  20.86,32.31 90 top
R43  18.32,37.39 270 top
R44  20.86,37.39 90 top
R45  18.32,42.47 270 top
R46  20.86,42.47 90 top
R47  21.11,50.8 180 top
R48  23.15,53.34 180 top
R49  6.38,56.13 0 bottom
R50  14.51,78.74 0 top
RESET  86.9,80.57 0 top
SERVO_0  98.33,16.05 0 top
SERVO_1  98.33,19.61 0 top
SERVO_2  98.33,22.91 0 top
SERVO_3  98.33,26.21 0 top
SG1  74.2,62.23 180 top
SPEAKER  27.21,30.28 0 top
SPI  81.82,32.31 180 top
SPI_ISP  72.93,32.31 180 top
SWITCH  120.43,76.76 0 top
USART  83.09,55.68 0 top
VBAT  32.54,30.23 0 top

### Tracks (layer width: path | path; a pad name or v marks a point on that pad's centre or on a via)
+1.8V_CPU
  Top 0.254: R18.2 Q6.1 10.7,16.12 | R16.2 Q5.1 10.75,11.99 10.7,11.99 10.7,16.12 | R12.2 Q3.1 29.75,12.94 | R10.2 Q2.1 29.75,8.86 29.75,12.94 | R14.2 Q4.1 29.75,18.02 | 10.7,16.12 10.7,18.34 11.97,19.61 14.51,19.61 17.05,22.15 CPU.4 19.08,27.99 30.26,27.99 31.02,27.23 31.02,19.61 29.75,18.34 29.75,18.02 | 29.75,18.02 29.75,12.94
+3V3  (via drill 0.38)
  Top 0.254: C15.1 IC9.2 7.16,50.29 5.62,50.29 | 5.62,50.29 4.6,50.29 3.59,49.28 3.3V.1 3.3V.2 3.3V.3 | v4.35,54.86 4.35,54.58 IC10.1 5.62,53.31 5.62,50.29
  Bottom 0.254: R49.2 5.43,55.95 v4.35,54.86
+5V  (via drill 0.38, 0.6, 0.9)
  Top 0.254: v70.39,72.9 70.39,73.15 70.14,73.41 | v105.19,4.83 105.7,4.83 105.95,5.08 | v56.93,52.83 56.42,53.34 56.42,52.82 IC1.80 | v64.04,54.86 64.04,54.61 | v68.36,44.7 68.61,44.45 69.12,44.45 | v60.99,43.18 60.99,42.67 61.27,42.67 IC1.10 | IC1.61 63.79,56.82 63.79,55.63 | IC1.31 69.37,45.32 69.37,44.96 | v24.42,28.7 24.16,28.7
  Top 0.406: 62.52,51.31 62.77,51.31 62.77,52.07
  Bottom 0.254: C13.2 26.59,21.2 IC11.6 26.7,21.2 26.7,21.34 25.94,22.1 25.94,27.18 v24.42,28.7 | R1.2 v70.39,72.9 | Q8.2 R31.2 102.38,4.05 102.65,4.32 104.68,4.32 v105.19,4.83 | C3.1 58.69,52.83 v56.93,52.83 | C4.1 v64.04,54.86 | C5.1 66.85,44.7 v68.36,44.7 | C14.1 61.25,44.64 61.25,43.43 v60.99,43.18 | ENCODER_L.2 55.61,32.51 55.15,32.51
  Bottom 0.61: SPI_ISP.2 77.3,29.21 82.53,29.21 SPI.2
  Bottom 0.813: 6.89,38.1 LIGHTS1.1
  Bottom 1.016: 6.89,38.1 8.67,39.88 11.21,39.88 13.7,37.39 ANALOG_3.2 27.97,37.34 38.64,37.34 | ANALOG_0.2 41.38,37.39 46.21,32.56 ENCODER_R.2 | 50.83,32.51 55.15,32.51 56.42,32.51 | ENCODER_L.2 58.91,32.56 64.04,27.43 IC7.VIN
  Bottom 1.27: 121.7,48.01 121.7,45.97 118.9,43.18 v111.03,43.18
  pour Top (isolate 0.254): 0,0 126,0 126,85 0,85
+5V_CPU
  Top 1.422: CPU_PWR.2 101.27,32.46 IC4.VOUT
+5V_H_BRIDGE
  Top 0.254: IC2.+5V 111.32,2.03 119.67,2.03 120.68,3.05 120.68,6.86 124.75,10.92 124.75,50.8 121.44,54.1 121.44,67.56 114.59,74.42 R27.2
  Bottom 0.254: Q8.3 106.87,3.1 IC2.+5V
+5V_S
  Top 1.422: SERVO_3.2 SERVO_2.2 SERVO_1.2 SERVO_0.2 98.33,13.72 99.35,12.7 105.19,12.7 106.47,13.98 IC5.VOUT
ADC0
  Top 0.254: IC1.85 52.07,50.32 43.72,58.67 GPIO.1
ADC1
  Top 0.254: IC1.84 52.34,50.82 44.99,58.17 44.99,62.79 GPIO.2
ADC2
  Top 0.254: IC1.83 52.6,51.32 46.26,57.66 GPIO.3
ADC3
  Top 0.254: GPIO.4 47.53,62.79 47.53,57.15 52.86,51.82 IC1.82
ANALOG0
  Top 0.254: IC1.97 43.03,44.32 ANALOG_0.1
ANALOG1
  Top 0.254: IC1.96 39.97,44.82 ANALOG_1.1
ANALOG2
  Top 0.254: IC1.95 36.92,45.32 ANALOG_2.1
ANALOG3
  Top 0.254: IC1.94 33.86,45.82 ANALOG_3.1
AUDIO+
  Top 0.254: R39.1 7.52,27.87 CPU.1
AUDIO-
  Top 0.254: CPU.2 9.94,23.93 8.49,23.93 R39.3
  Bottom 0.254: CPU.2 11.02,25.01 C12.1
BAT_CEL_1
  Top 0.254: BATTERY_CEL.P$2 42.96,73.46 42.96,68.63 40.42,66.09 40.42,54.41 45.51,49.32 IC1.87
BAT_CEL_2
  Top 0.254: R21.2 R20.1 36.86,57.2 45.24,48.82 IC1.88
BAT_CEL_2_HV
  Top 0.254: BATTERY_CEL.P$3 42.45,75.49 42.45,71.87 R20.2
BAT_CEL_3
  Top 0.254: R23.2 R22.1 34.58,58.73 44.98,48.32 IC1.89
BAT_CEL_3_HV
  Top 0.254: BATTERY_CEL.P$4 41.94,77.52 41.94,72.14 39.91,70.1 38.4,70.1 R22.2
BAT_CURRENT  (via drill 0.38)
  Top 0.254: IC8.VIOUT 86.52,64.88 C9.1 87.92,64.76 87.92,61.77 82.58,61.77 82.58,64.06 80.04,66.6 v71.91,66.6 | IC1.86 45.77,49.82 40.93,54.66 40.93,64.82 v43.72,67.62
  Bottom 0.254: v43.72,67.62 44.94,68.83 58.45,68.83 60.48,66.8 71.71,66.8 v71.91,66.6
BUZZER
  Top 0.254: IC1.52 68.27,59.55 SG1.+
ENABLE
  Bottom 0.254: SWITCH.2 121.7,59.18 111.54,49.02 IC6.EN
ENABLE_AUDIO  (via drill 0.38)
  Top 0.254: IC1.14 63.27,31.54 51.59,19.86 v51.59,19.61
  Bottom 0.254: R40.2 20.1,19.84 IC11.1 20.58,19.36 51.34,19.36 v51.59,19.61
ENABLE_CPU  (via drill 0.38)
  Top 0.254: IC1.47 77.43,53.32 v77.76,53.65 | R26.2 109.64,77.84 120.43,67.06 120.43,53.59 123.73,50.29 123.73,34.36 IC4.EN
  Bottom 0.254: v77.76,53.65 78.52,52.88 86.9,52.88 92.49,47.3 92.49,32.56 94.71,30.34 R29.2 IC4.EN
ENABLE_KINECT  (via drill 0.38)
  Top 0.254: IC1.48 76.15,53.82 v76.74,54.41 | v107.22,49.58 107.68,50.04 R34.1
  Bottom 0.254: v76.74,54.41 78.01,54.41 79.03,53.39 87.41,53.39 91.47,49.58 v107.22,49.58
ENABLE_MOTOR  (via drill 0.38)
  Top 0.254: IC1.36 82.57,47.82 84.11,46.28 v85.63,46.28
  Bottom 0.254: v85.63,46.28 86.14,46.28 88.93,43.49 88.93,5.59 90.47,4.05 R32.1
ENABLE_SERVO  (via drill 0.38)
  Top 0.254: IC1.35 70.79,47.3 82.33,47.3 84.36,45.26 v85.88,45.26 | R25.2 112.05,76.2 120.94,67.31 120.94,53.85 124.24,50.55 124.24,34.04 118.14,27.94 118.14,17.34 IC5.EN
  Bottom 0.254: v85.88,45.26 86.39,45.26 88.42,43.23 88.42,5.33 92.69,1.07 108.49,1.07 110.47,3.05 114.33,3.05 116.63,5.34 IC5.EN R30.2
ENCODER_L
  Top 0.254: IC1.7 59.77,31.85 57.94,30.02 ENCODER_L.1
ENCODER_R
  Top 0.254: IC1.8 60.27,31.59 57.13,28.45 52.86,28.45 52.1,29.21 ENCODER_R.1
GND  (via drill 0.38, 0.6, 2.8)
  Top 0.254: R23.1 37.37,71.36 DEBUG_USART.3 | R21.1 40.42,67.55 v40.42,67.62 | IC8.GND 83.98,67.49 v83.09,66.6 83.09,62.86 C8.2 C9.2 | C2.1 C1.1 85.88,37.96 v85.88,36.12 85.88,33.33 84.87,32.31 83.85,32.31 83.09,31.55 83.09,30.53 82.07,29.52 80.8,29.52 SPI.6 | C6.1 45.24,42.72 41.18,38.66 41.18,37.39 ANALOG_0.3 | IC1.81 56.17,52.32 v56.93,51.56 | IC1.99 56.31,43.32 v56.67,43.69 | IC1.32 68.71,45.82 v68.61,45.72 | IC1.62 63.27,55.11 v63.02,54.86 | IC1.11 61.77,42.18 v62.26,42.67 | C16.2 7.59,47.82 IC9.1 C15.2 11.7,47.82 v14.51,45.01 | IC10.19 7.1,66.59 7.4,66.29 v12.22,66.29 17.3,66.29 17.6,66.59 IC10.12 | IC10.8 16.1,50.8 | 16.1,50.8 16.1,46.74 | 16.1,46.74 16.1,46.6 | R47.2 16.1,50.8 | IC10.3 8.67,53.27 8.67,52.07 9.94,50.8 16.1,50.8 | 16.1,46.74 32.69,46.74 J1.P$1 J1.P$2 | LED14.C 16.8,80.77 17.81,79.76 JTAG_ISP.2
  Top 0.406: 16.1,46.6 v14.51,45.01
  Top 0.61: LED8.C LED7.C LED6.C LED5.C LED4.C LED3.C LED2.C LED1.C 74.95,83.65 BATTERY.V- | LED_+5V.C LED_KINECT.C LED_CPU.C LED_SERVO.C LED_MOTOR.C | R41.1 Q9.2 14.51,34.36 v14.51,34.85 | R43.1 Q10.2 14.51,39.44 v14.51,39.93 | R45.1 Q11.2 14.51,44.52 v14.51,45.01 | RESET.B2 91.71,83.65 97.57,83.65 C10.-
  Top 0.813: 97.57,83.65 LED_+5V.C 115.57,83.65 119.16,80.06 SWITCH.1 | C18.- 97.57,58.93 v95.79,57.15
  Top 1.27: C17.- 95.81,40.95 KINECT_PWR.2
  Bottom 0.254: IC11.9 22.45,20.55 IC11.7 | v40.42,67.62 40.67,67.87 41.18,67.87 | v85.88,36.12 85.38,36.12 | v56.93,51.56 57.69,50.8 | v56.67,43.69 57.18,44.2 | v68.61,45.72 68.36,45.47 | v63.02,54.86 62.52,54.36 | v62.26,42.67 62.52,42.93
  Bottom 0.61: v14.51,34.85 13.24,34.85 | v14.51,39.93 13.24,39.93 | v14.51,45.01 13.24,45.01 | 97.06,67.31 97.06,68.58
  Bottom 0.813: v95.79,57.15 94.52,58.42
  other vias: 15.27,6.86 110.52,10.16 33.05,52.83
  pour Bottom (isolate 0.254): 0,0 126,0 126,85 0,85
GPS_RESET  (via drill 0.38)
  Top 0.254: IC1.4 58.27,38.93 57.18,37.85 45.75,37.85 v45.5,38.1 | 7.14,53.29 IC10.2 7.1,51.35 v7.14,51.31
  Bottom 0.254: v45.5,38.1 44.99,38.61 44.99,39.88 38.13,46.74 11.72,46.74 v7.14,51.31 7.14,55.95 R49.1
I2C_SCL  (via drill 0.38)
  Top 0.254: v82.58,51.61 82.29,51.32 IC1.43 | IC7.SCL 71.67,20.89 71.67,19.04 79.28,11.43 | 79.28,11.43 79.48,11.23 I2C_2.4 | R36.1 79.28,10.15 79.28,11.43
  Bottom 0.254: v82.58,51.61 83.34,50.85 83.34,46.79 87.92,42.22 87.92,13.77 I2C_1.4 I2C_2.4
I2C_SDA  (via drill 0.38)
  Top 0.254: v81.57,52.12 81.26,51.82 IC1.44 | R35.1 80.36,13.77 I2C_2.3
  Bottom 0.254: v81.57,52.12 81.57,47.8 87.41,41.96 87.41,14.53 86.65,13.77 I2C_1.3 I2C_2.3 74.4,13.77 69.12,19.05 IC7.SDA
INT_CPU
  Top 0.254: Q4.3 R15.1 32.61,15.75 45.19,15.75 60.77,31.33 IC1.9
INT_CPU_LV
  Top 0.254: 25.94,15.8 26.26,16.12 Q4.2 R14.1 24.67,16.12 24.67,19.61 29.75,24.69 CPU.9
IO0
  Top 0.254: IC1.78 52.64,53.82 48.8,57.66 GPIO.5
IO1
  Top 0.254: IC1.77 52.9,54.32 50.07,57.15 50.07,62.79 GPIO.6
IO2
  Top 0.254: IC1.76 53.16,54.82 51.34,56.64 GPIO.7
IO3
  Top 0.254: GPIO.8 52.61,62.79 52.61,60.96 56.75,56.82 IC1.75
IO4
  Top 0.254: GPIO.9 57.27,58.13 IC1.74
IO5
  Top 0.254: GPIO.10 55.15,62.79 55.15,60.96 57.77,58.34 IC1.73
IO6
  Top 0.254: GPIO.11 58.27,59.67 IC1.72
IO7
  Top 0.254: GPIO.12 57.69,62.79 57.69,60.96 58.77,59.88 IC1.71
IO8
  Top 0.254: GPIO.13 59.77,60.71 IC1.69
IO9
  Top 0.254: IC1.68 60.27,62.75 GPIO.14
IO10
  Top 0.254: IC1.67 60.77,58.45 61.5,59.18 GPIO.15
IO11
  Top 0.254: IC1.66 61.27,58.19 62.77,59.69 62.77,62.79 GPIO.16
JTAG_TCK
  Top 0.254: IC1.93 43.93,46.32 19.9,70.36 18.32,70.36 17.81,70.87 JTAG_ISP.1
JTAG_TDI
  Top 0.254: IC1.90 44.72,47.82 27.97,64.57 JTAG_ISP.9
JTAG_TDO
  Top 0.254: IC1.91 44.46,47.32 24.16,67.62 24.16,72.14 23.4,72.9 21.57,72.9 JTAG_ISP.3
JTAG_TMS
  Top 0.254: IC1.92 44.2,46.82 22.89,68.12 JTAG_ISP.5
KINECT_LED  (via drill 0.38)
  Top 0.254: R28.2 106.97,76.2 107.98,75.18 111.54,75.18 119.92,66.8 119.92,53.34 123.22,50.04 123.22,42.67 v121.7,41.15
  Top 1.422: Q7.3 101.33,42.93 IC3.VIN
  Bottom 0.254: IC3.VIN 120.94,40.39 v121.7,41.15
LED0
  Top 0.254: R2.2 67.77,74.46 IC1.53
LED1
  Top 0.254: R3.2 67.27,76.25 IC1.54
LED2
  Top 0.254: R4.2 66.77,78.16 IC1.55
LED3
  Top 0.254: R5.2 64.04,77.01 66.27,74.78 IC1.56
LED4
  Top 0.254: R6.2 65.77,73.83 IC1.57
LED5
  Top 0.254: R7.2 65.27,71.79 IC1.58
LED6
  Top 0.254: R8.2 64.77,69.75 IC1.59
LED7
  Top 0.254: R9.2 64.27,67.71 IC1.60
LIGHTS0
  Top 0.254: R42.2 25.24,33.26 26.19,32.31 41.69,32.31 46.21,36.83 57.69,36.83 59.27,38.41 IC1.6
LIGHTS1
  Top 0.254: R44.2 25.24,38.34 25.43,38.15 25.43,33.83 26.45,32.82 41.43,32.82 45.95,37.34 57.44,37.34 58.77,38.67 IC1.5
LIGHTS2
  Top 0.254: IC1.1 56.64,40.95 44.74,40.95 42.96,39.17 42.96,35.1 41.18,33.33 26.7,33.33 25.94,34.09 25.94,39.12 21.64,43.42 R46.2
MOTOR_L1  (via drill 0.38)
  Top 0.254: IC1.42 70.8,50.85 v86.9,50.85
  Bottom 0.254: v86.9,50.85 91.47,46.28 91.47,15.55 100.32,6.69 IC2.L1
MOTOR_L2  (via drill 0.38)
  Top 0.254: IC1.41 70.79,50.34 85.12,50.34 85.38,50.09 v86.14,50.09
  Bottom 0.254: v86.14,50.09 90.96,45.26 90.96,13.95 97.78,7.13 IC2.L2
MOTOR_LPWM  (via drill 0.38)
  Top 0.254: IC1.40 70.79,49.84 84.87,49.84 85.38,49.33 v89.44,49.33
  Bottom 0.254: v89.44,49.33 91.98,46.79 91.98,15.8 94.52,13.26 95.73,13.26 IC2.LPWM
MOTOR_R1  (via drill 0.38)
  Top 0.254: IC1.37 82.84,48.31 84.11,47.04 v87.15,47.04
  Bottom 0.254: v87.15,47.04 89.95,44.5 89.95,9.89 92.7,7.13 IC2.R1
MOTOR_R2  (via drill 0.38)
  Top 0.254: IC1.38 83.09,48.82 83.85,48.06 v87.15,48.06
  Bottom 0.254: v87.15,48.06 90.46,45.01 90.46,11.92 95.24,7.13 IC2.R2
MOTOR_RPWM  (via drill 0.38)
  Top 0.254: IC1.39 83.6,49.33 v84.11,48.82
  Bottom 0.254: v84.11,48.82 89.44,43.74 89.44,7.85 90.16,7.13 IC2.RPWM
N$1
  Top 0.254: IC1.33 77.14,46.32 Q1.P$2 81.24,40.05 C1.2
N$2
  Top 0.254: IC1.34 80.34,46.82 Q1.P$1 84.94,39.94 C2.2
N$3
  Top 0.254: IC1.98 52.88,43.82 C6.2
N$4
  Top 0.254: R2.1 LED1.A
N$5
  Top 0.254: R3.1 LED2.A
N$6
  Top 0.254: R4.1 LED3.A
N$7
  Top 0.254: R5.1 LED4.A
N$8
  Top 0.254: R6.1 LED5.A
N$9
  Top 0.254: R7.1 LED6.A
N$10
  Top 0.254: R8.1 LED7.A
N$11
  Top 0.254: R9.1 LED8.A
N$12
  Top 0.254: R24.1 LED_+5V.A
N$13
  Top 1.93: 83.66,73.53 IC8.V-
  Top 2.184: BATTERY.V+ 78.12,73.52
  Top 2.54: 78.12,73.52 83.66,73.53
N$14
  Bottom 0.254: R32.2 R31.1 Q8.1
N$15
  Top 1.422: KINECT_PWR.1 99.29,38.41 102.39,35.31 IC3.VOUT
N$16
  Top 0.254: LED_SERVO.A R25.1
N$17
  Top 0.254: IC8.FILTER 85.25,65.64 C8.1
N$18
  Top 0.254: LED_CPU.A R26.1
N$19
  Top 0.254: LED_MOTOR.A R27.1
N$20
  Top 0.254: R28.1 LED_KINECT.A
N$21
  Top 0.254: Q7.1 106.62,54.84 R34.2 R33.1
N$22
  Bottom 0.254: R37.1 18.83,21.2 IC11.3
N$23
  Bottom 0.254: R38.1 17.53,21.86 IC11.4
N$24
  Bottom 0.254: C11.2 R37.2
N$25
  Bottom 0.254: C12.2 R38.2
N$26
  Bottom 0.254: IC11.5 23.4,22.68 23.4,29.72 23.96,30.28 SPEAKER.1
N$27  (via drill 0.38)
  Top 0.254: v2.32,23.42 1.35,24.9 R39.2
  Bottom 0.254: C11.1 7.21,23.42 v2.32,23.42
N$28
  Bottom 0.254: IC11.8 27.72,19.91 27.72,22.66 28.48,23.42 SPEAKER.2
N$29
  Top 0.406: LIGHTS0.2 Q9.3
N$30
  Top 0.254: Q9.1 R41.2 R42.1
N$31
  Top 0.406: LIGHTS1.2 Q10.3
N$32
  Top 0.254: Q10.1 R43.2 R44.1
N$33
  Top 0.406: LIGHTS2.2 Q11.3
N$34
  Top 0.254: Q11.1 R45.2 R46.1
N$35
  Top 0.254: R48.2 22.19,53.33 | 22.19,53.33 IC10.10 | 22.19,53.33 22.06,53.21 R47.1
N$36
  Top 0.254: IC10.5 11.6,56.25 4.1,63.75 4.1,69.6 4.86,70.36 12.99,70.36 15.46,72.83 R50.2
N$37
  Top 0.254: LED14.A 13.56,80.67 R50.1
N$38
  Top 0.254: IC10.11 19.1,68.05 19.34,67.82 21.62,67.82 36.35,53.09 J1.P$3
PWM0
  Top 0.254: IC1.23 67.77,39.5 69.37,37.9 PWM.1
PWM1
  Top 0.254: IC1.24 68.27,39.68 69.63,39.68 69.88,39.93 71.66,39.93 73.18,38.41 PWM.2
PWM2
  Top 0.254: IC1.25 68.77,40.18 69.37,40.18 69.63,40.44 73.18,40.44 PWM.3
PWM3
  Top 0.254: IC1.26 73.6,42.82 78.26,38.15 PWM.4
RESET  (via drill 0.38)
  Top 0.254: v74.45,44.76 74.39,44.82 IC1.30 | v71.66,74.22 74.45,77.01 89.57,77.01 RESET.A2
  Bottom 0.254: SPI_ISP.5 72.68,35.87 73.69,35.87 74.45,36.63 v74.45,44.76 74.45,67.94 C7.2 71.66,69.46 | 71.66,69.46 R1.1 68.29,67.36 60.74,67.36 58.71,69.39 33.81,69.39 30.26,72.95 30.21,72.9 24.21,72.9 JTAG_ISP.6 | v71.66,74.22 71.66,69.46
SERVO0
  Top 0.254: IC1.15 63.77,31.56 69.63,25.71 86.14,25.71 SERVO_0.1
SERVO1
  Top 0.254: IC1.16 64.27,31.83 69.88,26.21 89.19,26.21 SERVO_1.1
SERVO2
  Top 0.254: IC1.17 64.77,32.09 70.14,26.72 91.98,26.72 SERVO_2.1
SERVO3
  Top 0.254: IC1.18 65.31,40.78 65.31,32.31 70.39,27.23 94.77,27.23 SERVO_3.1 95.28,27.23
SPI_MISO
  Top 0.254: IC1.22 67.27,38.22 69.63,35.87 73.18,35.87 SPI_ISP.1 77.25,35.36 82.58,35.36 SPI.1
SPI_MOSI
  Top 0.254: SPI_ISP.4 74.2,32.31 | 74.2,32.31 74.2,34.09 72.93,35.36 69.37,35.36 66.77,37.96 IC1.21 | SPI.4 80.55,32.31 80.55,34.09 79.79,34.85 77.76,34.85 76.74,33.83 76.74,33.07 75.98,32.31 74.2,32.31
SPI_SCK
  Top 0.254: SPI_ISP.3 71.66,34.85 69.12,34.85 66.27,37.7 IC1.20
  Bottom 0.254: SPI.3 80.55,32.31 74.2,32.31 SPI_ISP.3
SPI_SS
  Top 0.254: IC1.19 65.77,32.61 70.64,27.74 75.47,27.74 77.5,29.77 77.5,31.8 SPI.5
USART1_CPU_RX
  Top 0.254: Q6.3 R19.1 | CPU_USART.2 6.13,72.9 5.11,71.88 3.33,71.88 1.3,69.85 1.3,33.53 5.11,29.72 5.11,19.05 4.1,18.03 4.1,16.26 4.86,15.49 7.84,15.49 R19.1 | 7.84,17.85 R19.1
USART1_CPU_RX_LV
  Top 0.254: Q6.2 R18.1 19.59,23.37 CPU.5
USART1_CPU_TX
  Top 0.254: Q5.3 R17.1 7.84,13.21 5.11,13.21 3.59,14.73 3.59,18.29 4.35,19.05 4.35,29.72 0.79,33.27 0.79,71.43 CPU_USART.1
USART1_CPU_TX_LV
  Top 0.254: Q5.2 R16.1 22.13,20.83 CPU.6
USART1_RX
  Top 0.254: IC1.45 80.75,52.32 81.31,52.88 84.11,52.88 USART.4
USART1_TX
  Top 0.254: IC1.46 80.49,52.82 81.06,53.39 82.07,53.39 USART.3
USART_CPU_RX
  Top 0.254: Q3.3 R13.1 32.61,13.46 43.67,13.46 62.27,32.06 IC1.12
USART_CPU_RX_LV
  Top 0.254: Q3.2 R12.1 24.16,11.04 24.16,19.86 27.21,22.91 CPU.8
USART_CPU_TX
  Top 0.254: Q2.3 R11.1 32.61,8.18 39.15,8.18 62.77,31.8 IC1.13
USART_CPU_TX_LV
  Top 0.254: Q2.2 R10.1 23.65,5.96 23.65,20.12 24.67,21.13 CPU.7
USART_DEBUG_RX  (via drill 0.38)
  Top 0.254: v62.26,68.38 63.79,66.85 63.79,59.18 62.77,58.17 IC1.63
  Bottom 0.254: DEBUG_USART.2 38.64,70.41 60.23,70.41 v62.26,68.38
USART_DEBUG_TX  (via drill 0.38)
  Top 0.254: v60.23,69.39 63.28,66.35 63.28,59.44 62.27,58.43 IC1.64
  Bottom 0.254: DEBUG_USART.1 36.61,69.9 59.72,69.9 v60.23,69.39
USART_GPS_RX  (via drill 0.38)
  Top 0.254: IC1.2 57.27,39.46 56.67,38.86 47.53,38.86 v46.51,39.88 | IC10.9 17.6,54.15 18.57,55.12 24.92,55.12 25.69,54.36 25.69,49.53 v26.7,48.51
  Bottom 0.254: v46.51,39.88 38.64,47.75 27.46,47.75 v26.7,48.51
USART_GPS_TX  (via drill 0.38)
  Top 0.254: IC1.3 57.77,39.2 56.93,38.35 46.77,38.35 v46.26,38.86 | v24.92,48.26 24.1,49.09 R48.1
  Bottom 0.254: v46.26,38.86 45.5,39.62 45.5,40.13 38.39,47.24 25.94,47.24 v24.92,48.26
V+
  Top 0.61: C10.+ 97.06,72.71 97.06,73.52
  Top 0.813: C17.+ 97.73,53.53 Q7.2
  Top 1.27: C18.+ C10.+
  Top 1.422: Q7.2 101.36,57.15 114.07,57.15
  Top 1.93: 87.72,73.52 IC8.V+
  Top 2.54: 87.72,73.52 93.41,73.52 97.06,73.52 106.09,73.52 114.07,65.54 114.07,57.15 IC6.V+ 114.09,47.91 IC4.V+ IC5.V+ 114.09,8.27 IC2.+12V
  Bottom 0.813: IC4.V+ 114.09,22.86 C20.P$1 | IC2.+12V 117.56,7.28 C19.P$1
VBAT  (via drill 0.38)
  Top 0.254: v47.02,36.07 46.26,36.07 41.94,31.75 39.66,31.75 G1.+ 35.59,30.23 VBAT.2 | v10.45,51.56 10.1,51.91 IC10.4
  Bottom 0.254: v47.02,36.07 47.28,36.32 47.28,40.13 46.77,40.64 46.51,40.64 38.89,48.26 28.48,48.26 27.21,49.53 12.48,49.53 v10.45,51.56